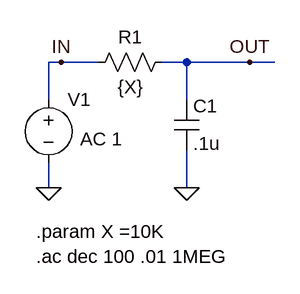
[diagram p0: schematic RCFilterACAnalysis_Param.asc]
RCFilterACAnalysis_Param.asc, the LTspice schematic file:
Version 4
SHEET 1 880 680
WIRE 64 128 48 128
WIRE 112 128 64 128
WIRE 224 128 192 128
WIRE 304 128 224 128
WIRE 336 128 304 128
WIRE 48 176 48 128
WIRE 224 176 224 128
WIRE 48 288 48 256
WIRE 224 288 224 240
FLAG 224 288 0
FLAG 48 288 0
FLAG 304 128 OUT
FLAG 64 128 IN
SYMBOL res 208 112 R90
WINDOW 0 0 56 VBottom 2
WINDOW 3 32 56 VTop 2
SYMATTR InstName R1
SYMATTR Value {X}
SYMBOL cap 208 176 R0
SYMATTR InstName C1
SYMATTR Value .1u
SYMBOL voltage 48 160 R0
WINDOW 3 -13 168 Left 2
WINDOW 123 40 66 Left 2
WINDOW 39 0 0 Left 2
SYMATTR Value ""
SYMATTR Value2 AC 1
SYMATTR InstName V1
TEXT 32 376 Left 2 !.ac dec 100 .01 1MEG
TEXT 32 344 Left 2 !.param X =10K

The netlist it stands for:
* RCFilterACAnalysis_Param.asc
R1 OUT IN {X}
C1 OUT 0 .1u
V1 IN 0 AC 1
.ac dec 100 .01 1MEG
.param X =10K
.backanno
.end